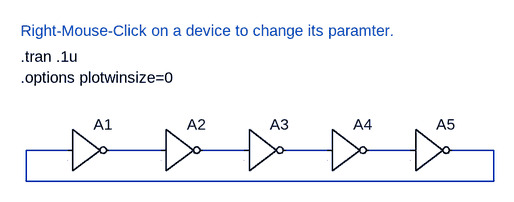
[diagram p0: schematic Ring_oscillator5.asc]
Ring_oscillator5.asc, the LTspice schematic file:
Version 4
SHEET 1 880 680
WIRE -32 192 -96 192
WIRE 112 192 32 192
WIRE 240 192 176 192
WIRE 368 192 304 192
WIRE 496 192 432 192
WIRE 624 192 560 192
WIRE -96 240 -96 192
WIRE 624 240 624 192
WIRE 624 240 -96 240
SYMBOL Digital\\inv -32 128 R0
SYMATTR InstName A1
SYMATTR Value2 td=1n trise=1n
SYMATTR SpiceLine vhigh=1.5
SYMATTR SpiceLine2 tripdt=100p
SYMBOL Digital\\inv 112 128 R0
SYMATTR InstName A2
SYMATTR Value2 td=1n trise=1n
SYMATTR SpiceLine vhigh=1.5
SYMATTR SpiceLine2 tripdt=100p
SYMBOL Digital\\inv 240 128 R0
SYMATTR InstName A3
SYMATTR Value2 td=1n trise=1n
SYMATTR SpiceLine vhigh=1.5
SYMATTR SpiceLine2 tripdt=100p
SYMBOL Digital\\inv 368 128 R0
SYMATTR InstName A4
SYMATTR Value2 td=1n trise=1n
SYMATTR SpiceLine vhigh=1.5
SYMATTR SpiceLine2 tripdt=100p
SYMBOL Digital\\inv 496 128 R0
SYMATTR InstName A5
SYMATTR Value2 td=1n trise=1n
SYMATTR SpiceLine vhigh=1.5
SYMATTR SpiceLine2 tripdt=100p
TEXT -104 48 Left 0 !.tran .1u
TEXT -104 8 Left 0 ;Right-Mouse-Click on a device to change its paramter.
TEXT -104 80 Left 0 !.options plotwinsize=0

The netlist it stands for:
* Ring_oscillator5.asc
A1 N001 0 0 0 0 N002 0 0 BUF td=1n trise=1n vhigh=1.5 tripdt=100p
A2 N002 0 0 0 0 N003 0 0 BUF td=1n trise=1n vhigh=1.5 tripdt=100p
A3 N003 0 0 0 0 N004 0 0 BUF td=1n trise=1n vhigh=1.5 tripdt=100p
A4 N004 0 0 0 0 N005 0 0 BUF td=1n trise=1n vhigh=1.5 tripdt=100p
A5 N005 0 0 0 0 N001 0 0 BUF td=1n trise=1n vhigh=1.5 tripdt=100p
.tran .1u
* Right-Mouse-Click on a device to change its paramter.
.options plotwinsize=0
.backanno
.end